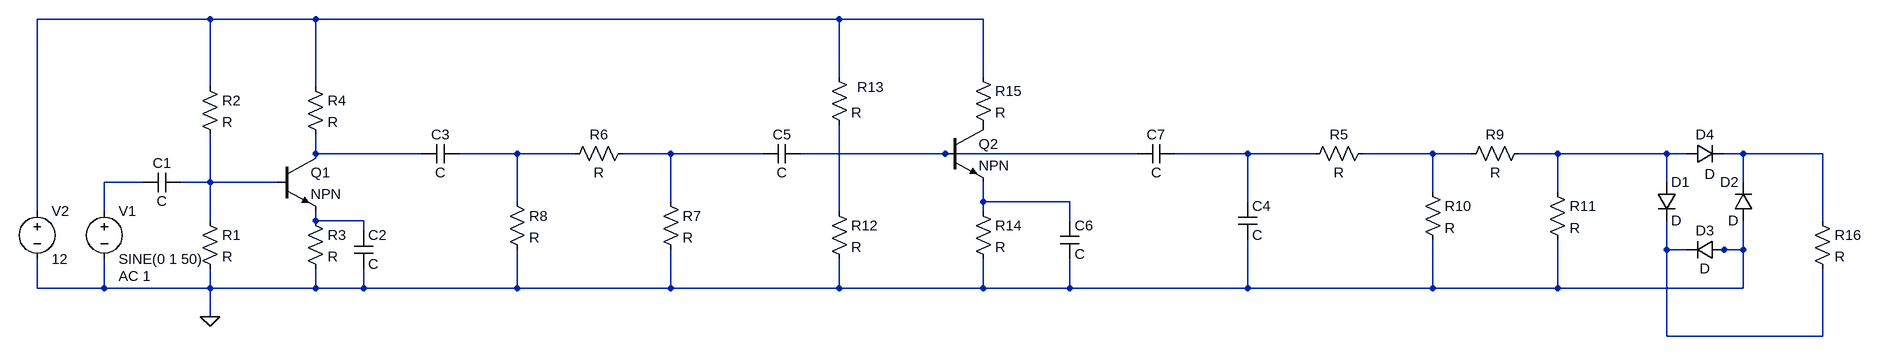
[diagram p0: schematic Draft1.asc]
Draft1.asc, the LTspice schematic file:
Version 4
SHEET 1 3684 680
WIRE 160 -288 -128 -288
WIRE 336 -288 160 -288
WIRE 1264 -288 336 -288
WIRE 1504 -288 1264 -288
WIRE 1264 -192 1264 -288
WIRE 1504 -192 1504 -288
WIRE 160 -176 160 -288
WIRE 336 -176 336 -288
WIRE 336 -64 336 -96
WIRE 512 -64 336 -64
WIRE 672 -64 576 -64
WIRE 768 -64 672 -64
WIRE 928 -64 848 -64
WIRE 1136 -64 928 -64
WIRE 1440 -64 1200 -64
WIRE 1760 -64 1440 -64
WIRE 2016 -64 1824 -64
WIRE 2128 -64 2016 -64
WIRE 2368 -64 2208 -64
WIRE 2432 -64 2368 -64
WIRE 2576 -64 2512 -64
WIRE 3296 -64 2576 -64
WIRE 3328 -64 3296 -64
WIRE 3424 -64 3392 -64
WIRE 3616 -64 3424 -64
WIRE 48 -16 -16 -16
WIRE 160 -16 160 -96
WIRE 160 -16 112 -16
WIRE 272 -16 160 -16
WIRE 3296 -16 3296 -64
WIRE 3424 -16 3424 -64
WIRE 2368 0 2368 -64
WIRE 2576 0 2576 -64
WIRE 672 16 672 -64
WIRE 928 16 928 -64
WIRE 1504 16 1504 -16
WIRE 1648 16 1504 16
WIRE 2016 16 2016 -64
WIRE -128 32 -128 -288
WIRE -16 32 -16 -16
WIRE 1264 32 1264 -112
WIRE 1504 32 1504 16
WIRE 160 48 160 -16
WIRE 336 48 336 32
WIRE 416 48 336 48
WIRE 1648 48 1648 16
WIRE 3616 48 3616 -64
WIRE 416 64 416 48
WIRE 3296 96 3296 48
WIRE 3328 96 3296 96
WIRE 3392 96 3376 96
WIRE 3424 96 3424 48
WIRE 3424 96 3392 96
WIRE -128 160 -128 112
WIRE -16 160 -16 112
WIRE -16 160 -128 160
WIRE 160 160 160 128
WIRE 160 160 -16 160
WIRE 336 160 336 128
WIRE 336 160 160 160
WIRE 416 160 416 128
WIRE 416 160 336 160
WIRE 672 160 672 96
WIRE 672 160 416 160
WIRE 928 160 928 96
WIRE 928 160 672 160
WIRE 1264 160 1264 112
WIRE 1264 160 928 160
WIRE 1504 160 1504 112
WIRE 1504 160 1264 160
WIRE 1648 160 1648 112
WIRE 1648 160 1504 160
WIRE 2016 160 2016 80
WIRE 2016 160 1648 160
WIRE 2368 160 2368 80
WIRE 2368 160 2016 160
WIRE 2576 160 2576 80
WIRE 2576 160 2368 160
WIRE 3424 160 3424 96
WIRE 3424 160 2576 160
WIRE 160 208 160 160
WIRE 3296 240 3296 96
WIRE 3616 240 3616 128
WIRE 3616 240 3296 240
FLAG 160 208 0
SYMBOL cap 112 -32 R90
WINDOW 0 0 32 VBottom 2
WINDOW 3 32 32 VTop 2
SYMATTR InstName C1
SYMBOL res 144 32 R0
SYMATTR InstName R1
SYMBOL res 144 -192 R0
SYMATTR InstName R2
SYMBOL npn 272 -64 R0
SYMATTR InstName Q1
SYMBOL res 320 32 R0
SYMATTR InstName R3
SYMBOL cap 400 64 R0
SYMATTR InstName C2
SYMBOL cap 576 -80 R90
WINDOW 0 0 32 VBottom 2
WINDOW 3 32 32 VTop 2
SYMATTR InstName C3
SYMBOL res 320 -192 R0
SYMATTR InstName R4
SYMBOL cap 2000 16 R0
SYMATTR InstName C4
SYMBOL res 2224 -80 R90
WINDOW 0 0 56 VBottom 2
WINDOW 3 32 56 VTop 2
SYMATTR InstName R5
SYMBOL res 864 -80 R90
WINDOW 0 0 56 VBottom 2
WINDOW 3 32 56 VTop 2
SYMATTR InstName R6
SYMBOL res 912 0 R0
SYMATTR InstName R7
SYMBOL res 656 0 R0
SYMATTR InstName R8
SYMBOL res 2528 -80 R90
WINDOW 0 0 56 VBottom 2
WINDOW 3 32 56 VTop 2
SYMATTR InstName R9
SYMBOL res 2352 -16 R0
SYMATTR InstName R10
SYMBOL res 2560 -16 R0
SYMATTR InstName R11
SYMBOL cap 1200 -80 R90
WINDOW 0 0 32 VBottom 2
WINDOW 3 32 32 VTop 2
SYMATTR InstName C5
SYMBOL res 1248 -208 R0
WINDOW 0 46 33 Left 2
SYMATTR InstName R13
SYMBOL npn 1440 -112 R0
SYMATTR InstName Q2
SYMBOL res 1488 16 R0
SYMATTR InstName R14
SYMBOL cap 1632 48 R0
SYMATTR InstName C6
SYMBOL res 1488 -208 R0
SYMATTR InstName R15
SYMBOL cap 1824 -80 R90
WINDOW 0 0 32 VBottom 2
WINDOW 3 32 32 VTop 2
SYMATTR InstName C7
SYMBOL res 1248 16 R0
SYMATTR InstName R12
SYMBOL diode 3280 -16 R0
SYMATTR InstName D1
SYMBOL diode 3440 48 R180
WINDOW 0 24 64 Left 2
WINDOW 3 24 0 Left 2
SYMATTR InstName D2
SYMBOL diode 3392 80 R90
WINDOW 0 0 32 VBottom 2
WINDOW 3 32 32 VTop 2
SYMATTR InstName D3
SYMBOL diode 3328 -48 R270
WINDOW 0 32 32 VTop 2
WINDOW 3 -3 40 VBottom 2
SYMATTR InstName D4
SYMBOL res 3600 32 R0
SYMATTR InstName R16
SYMBOL voltage -16 16 R0
WINDOW 123 24 124 Left 2
WINDOW 39 0 0 Left 0
SYMATTR InstName V1
SYMATTR Value SINE(0 1 50)
SYMATTR Value2 AC 1
SYMBOL voltage -128 16 R0
WINDOW 123 0 0 Left 0
WINDOW 39 0 0 Left 0
SYMATTR InstName V2
SYMATTR Value 12

The netlist it stands for:
* Draft1.asc
C1 N011 N010 C
R1 N011 0 R
R2 N001 N011 R
Q1 N002 N011 N014 0 NPN
R3 N014 0 R
C2 N014 0 C
C3 N003 N002 C
R4 N001 N002 R
C4 N006 0 C
R5 N007 N006 R
R6 N004 N003 R
R7 N004 0 R
R8 N003 0 R
R9 N008 N007 R
R10 N007 0 R
R11 N008 0 R
C5 N005 N004 C
R13 N001 N013 R
Q2 P001 N005 N012 0 NPN
R14 N012 0 R
C6 N012 0 C
R15 N001 P001 R
C7 N006 N005 C
R12 N013 0 R
D1 N008 N015 D
D2 0 N009 D
D3 0 N015 D
D4 N008 N009 D
R16 N009 N015 R
V1 N010 0 SINE(0 1 50) AC 1
V2 N001 0 12
.model D D
.lib standard.dio
.model NPN NPN
.model PNP PNP
.lib standard.bjt
.backanno
.end